# Altium schematic sheet KlokWave.Wave.SchDoc
size A4; SheetNumber: 2; SheetTotal: 3
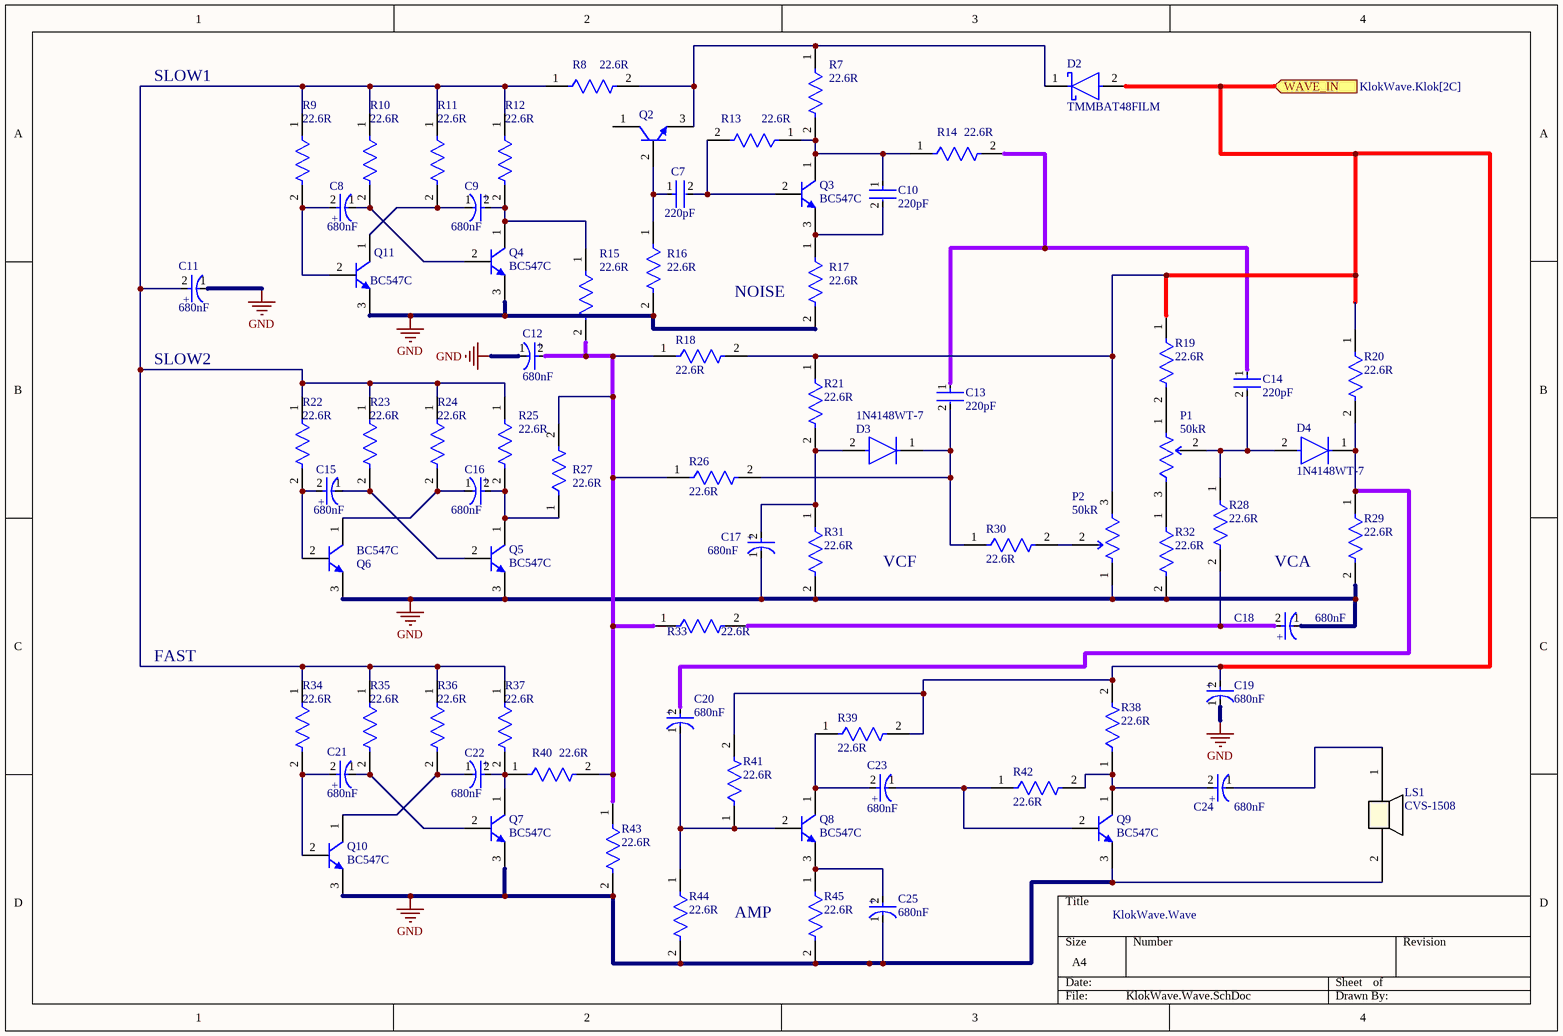
[diagram p0: KlokWave.Wave.SchDoc]

## Parts
C7  Capacitance: 220pF  [SMD RES: 0805ph]  (hidden comment: CL21C221FBANNNC)
C8  Capacitance: 680nF  [SMD Elco pol: FP-OS-CON-SMT-C6-MFG]  (hidden comment: FP-OS-CON-SMT-C6-MFG)
C9  Capacitance: 680nF  [SMD Elco pol: FP-OS-CON-SMT-C6-MFG]  (hidden comment: FP-OS-CON-SMT-C6-MFG)
C10  Capacitance: 220pF  [SMD RES: 0805ph]  (hidden comment: CL21C221FBANNNC)
C11  Capacitance: 680nF  [SMD Elco pol: FP-OS-CON-SMT-C6-MFG]  (hidden comment: FP-OS-CON-SMT-C6-MFG)
C12  Capacitance: 680nF  [SMD Elco pol: FP-OS-CON-SMT-C6-MFG]  (hidden comment: FP-OS-CON-SMT-C6-MFG)
C13  Capacitance: 220pF  [SMD RES: 0805ph]  (hidden comment: CL21C221FBANNNC)
C14  Capacitance: 220pF  [SMD RES: 0805ph]  (hidden comment: CL21C221FBANNNC)
C15  Capacitance: 680nF  [SMD Elco pol: FP-OS-CON-SMT-C6-MFG]  (hidden comment: FP-OS-CON-SMT-C6-MFG)
C16  Capacitance: 680nF  [SMD Elco pol: FP-OS-CON-SMT-C6-MFG]  (hidden comment: FP-OS-CON-SMT-C6-MFG)
C17  Capacitance: 680nF  [SMD Elco pol: FP-OS-CON-SMT-C6-MFG]  (hidden comment: FP-OS-CON-SMT-C6-MFG)
C18  Capacitance: 680nF  [SMD Elco pol: FP-OS-CON-SMT-C6-MFG]  (hidden comment: FP-OS-CON-SMT-C6-MFG)
C19  Capacitance: 680nF  [SMD Elco pol: FP-OS-CON-SMT-C6-MFG]  (hidden comment: FP-OS-CON-SMT-C6-MFG)
C20  Capacitance: 680nF  [SMD Elco pol: FP-OS-CON-SMT-C6-MFG]  (hidden comment: FP-OS-CON-SMT-C6-MFG)
C21  Capacitance: 680nF  [SMD Elco pol: FP-OS-CON-SMT-C6-MFG]  (hidden comment: FP-OS-CON-SMT-C6-MFG)
C22  Capacitance: 680nF  [SMD Elco pol: FP-OS-CON-SMT-C6-MFG]  (hidden comment: FP-OS-CON-SMT-C6-MFG)
C23  Capacitance: 680nF  [SMD Elco pol: FP-OS-CON-SMT-C6-MFG]  (hidden comment: FP-OS-CON-SMT-C6-MFG)
C24  Capacitance: 680nF  [SMD Elco pol: FP-OS-CON-SMT-C6-MFG]  (hidden comment: FP-OS-CON-SMT-C6-MFG)
C25  Capacitance: 680nF  [SMD Elco pol: FP-OS-CON-SMT-C6-MFG]  (hidden comment: FP-OS-CON-SMT-C6-MFG)
D2  TMMBAT48FILM  [SMD Diode BAT48 FP-MINIMELF-MFG]
D3  1N4148WT-7  [SMD Diode Rect: FP-SOD523-MFG]
D4  1N4148WT-7  [SMD Diode Rect: FP-SOD523-MFG]
LS1  CVS-1508  [THT speaker: CVS-1508_CUD]
P1  Resistance: 50kR  [SMD POT: FP-3361P-MFG]  (hidden comment: 3361P-1-503GLF)
P2  Resistance: 50kR  [SMD POT: FP-3361P-MFG]  (hidden comment: 3361P-1-503GLF)
Q2  BC547C  [THT NPN Transistor: ONSC-TO-92-3-29-11_AM_BL]  (value not drawn)
Q3  BC547C  [THT NPN Transistor: ONSC-TO-92-3-29-11_AM_BL]
Q4  BC547C  [THT NPN Transistor: ONSC-TO-92-3-29-11_AM_BL]
Q5  BC547C  [THT NPN Transistor: ONSC-TO-92-3-29-11_AM_BL]
Q6  BC547C  [THT NPN Transistor: ONSC-TO-92-3-29-11_AM_BL]
Q7  BC547C  [THT NPN Transistor: ONSC-TO-92-3-29-11_AM_BL]
Q8  BC547C  [THT NPN Transistor: ONSC-TO-92-3-29-11_AM_BL]
Q9  BC547C  [THT NPN Transistor: ONSC-TO-92-3-29-11_AM_BL]
Q10  BC547C  [THT NPN Transistor: ONSC-TO-92-3-29-11_AM_BL]
Q11  BC547C  [THT NPN Transistor: ONSC-TO-92-3-29-11_AM_BL]
R7  Resistance: 22.6R  [SMD RES: 0805ph]  (hidden comment: CR0805-FX-22R6ELF)
R8  Resistance: 22.6R  [SMD RES: 0805ph]  (hidden comment: CR0805-FX-22R6ELF)
R9  Resistance: 22.6R  [SMD RES: 0805ph]  (hidden comment: CR0805-FX-22R6ELF)
R10  Resistance: 22.6R  [SMD RES: 0805ph]  (hidden comment: CR0805-FX-22R6ELF)
R11  Resistance: 22.6R  [SMD RES: 0805ph]  (hidden comment: CR0805-FX-22R6ELF)
R12  Resistance: 22.6R  [SMD RES: 0805ph]  (hidden comment: CR0805-FX-22R6ELF)
R13  Resistance: 22.6R  [SMD RES: 0805ph]  (hidden comment: CR0805-FX-22R6ELF)
R14  Resistance: 22.6R  [SMD RES: 0805ph]  (hidden comment: CR0805-FX-22R6ELF)
R15  Resistance: 22.6R  [SMD RES: 0805ph]  (hidden comment: CR0805-FX-22R6ELF)
R16  Resistance: 22.6R  [SMD RES: 0805ph]  (hidden comment: CR0805-FX-22R6ELF)
R17  Resistance: 22.6R  [SMD RES: 0805ph]  (hidden comment: CR0805-FX-22R6ELF)
R18  Resistance: 22.6R  [SMD RES: 0805ph]  (hidden comment: CR0805-FX-22R6ELF)
R19  Resistance: 22.6R  [SMD RES: 0805ph]  (hidden comment: CR0805-FX-22R6ELF)
R20  Resistance: 22.6R  [SMD RES: 0805ph]  (hidden comment: CR0805-FX-22R6ELF)
R21  Resistance: 22.6R  [SMD RES: 0805ph]  (hidden comment: CR0805-FX-22R6ELF)
R22  Resistance: 22.6R  [SMD RES: 0805ph]  (hidden comment: CR0805-FX-22R6ELF)
R23  Resistance: 22.6R  [SMD RES: 0805ph]  (hidden comment: CR0805-FX-22R6ELF)
R24  Resistance: 22.6R  [SMD RES: 0805ph]  (hidden comment: CR0805-FX-22R6ELF)
R25  Resistance: 22.6R  [SMD RES: 0805ph]  (hidden comment: CR0805-FX-22R6ELF)
R26  Resistance: 22.6R  [SMD RES: 0805ph]  (hidden comment: CR0805-FX-22R6ELF)
R27  Resistance: 22.6R  [SMD RES: 0805ph]  (hidden comment: CR0805-FX-22R6ELF)
R28  Resistance: 22.6R  [SMD RES: 0805ph]  (hidden comment: CR0805-FX-22R6ELF)
R29  Resistance: 22.6R  [SMD RES: 0805ph]  (hidden comment: CR0805-FX-22R6ELF)
R30  Resistance: 22.6R  [SMD RES: 0805ph]  (hidden comment: CR0805-FX-22R6ELF)
R31  Resistance: 22.6R  [SMD RES: 0805ph]  (hidden comment: CR0805-FX-22R6ELF)
R32  Resistance: 22.6R  [SMD RES: 0805ph]  (hidden comment: CR0805-FX-22R6ELF)
R33  Resistance: 22.6R  [SMD RES: 0805ph]  (hidden comment: CR0805-FX-22R6ELF)
R34  Resistance: 22.6R  [SMD RES: 0805ph]  (hidden comment: CR0805-FX-22R6ELF)
R35  Resistance: 22.6R  [SMD RES: 0805ph]  (hidden comment: CR0805-FX-22R6ELF)
R36  Resistance: 22.6R  [SMD RES: 0805ph]  (hidden comment: CR0805-FX-22R6ELF)
R37  Resistance: 22.6R  [SMD RES: 0805ph]  (hidden comment: CR0805-FX-22R6ELF)
R38  Resistance: 22.6R  [SMD RES: 0805ph]  (hidden comment: CR0805-FX-22R6ELF)
R39  Resistance: 22.6R  [SMD RES: 0805ph]  (hidden comment: CR0805-FX-22R6ELF)
R40  Resistance: 22.6R  [SMD RES: 0805ph]  (hidden comment: CR0805-FX-22R6ELF)
R41  Resistance: 22.6R  [SMD RES: 0805ph]  (hidden comment: CR0805-FX-22R6ELF)
R42  Resistance: 22.6R  [SMD RES: 0805ph]  (hidden comment: CR0805-FX-22R6ELF)
R43  Resistance: 22.6R  [SMD RES: 0805ph]  (hidden comment: CR0805-FX-22R6ELF)
R44  Resistance: 22.6R  [SMD RES: 0805ph]  (hidden comment: CR0805-FX-22R6ELF)
R45  Resistance: 22.6R  [SMD RES: 0805ph]  (hidden comment: CR0805-FX-22R6ELF)

## Ports
WAVE_IN (in, see KlokWave.Klok[2C])

## Nets
GND: C11.1(C) C12.1(C) C17.1(C) C18.1(C) C19.1(C) C25.1(C) LS1.2 P2.1(CCW) Q4.3(E) Q5.3(E) Q6.3(E) Q7.3(E) Q9.3(E) Q10.3(E) Q11.3(E) R16.2 R17.2 R29.2 R31.2 R32.2 R43.2 R44.2 R45.2
WAVE_IN: C19.2(A) D2.2(A) P2.3(CW) R18.2 R19.1 R20.1 R21.1 R38.2 R39.2 R41.2 ; port WAVE_IN
NetC7_1: C7.1 Q2.2(B) R16.1
NetC7_2: C7.2 Q3.2(B) R13.2
NetC8_1: C8.1(C) Q4.2(B) R10.2
NetC8_2: C8.2(A) Q11.2(B) R9.2
NetC9_1: C9.1(C) Q11.1(C) R11.2
NetC9_2: C9.2(A) Q4.1(C) R12.2 R15.1
NetC10_1: C10.1 Q3.1(C) R7.2 R13.1 R14.1
NetC10_2: C10.2 Q3.3(E) R17.1
NetC11_2: C11.2(A) R8.1 R9.1 R10.1 R11.1 R12.1 R22.1 R23.1 R24.1 R25.1 R34.1 R35.1 R36.1 R37.1
NetC12_2: C12.2(A) R15.2 R18.1 R26.1 R27.2 R33.1 R40.2 R43.1
NetC13_1: C13.1 C14.1 R14.2
NetC13_2: C13.2 D3.1(C) R26.2 R30.1
NetC14_2: C14.2 D4.2(A) P1.2(WIPER) R28.1
NetC15_1: C15.1(C) Q5.2(B) R23.2
NetC15_2: C15.2(A) Q6.2(B) R22.2
NetC16_1: C16.1(C) Q6.1(C) R24.2
NetC16_2: C16.2(A) Q5.1(C) R25.2 R27.1
NetC17_2: C17.2(A) D3.2(A) R21.2 R31.1
NetC18_2: C18.2(A) R28.2 R33.2
NetC20_1: C20.1(C) Q8.2(B) R41.1 R44.1
NetC20_2: C20.2(A) D4.1(C) R20.2 R29.1
NetC21_1: C21.1(C) Q7.2(B) R35.2
NetC21_2: C21.2(A) Q10.2(B) R34.2
NetC22_1: C22.1(C) Q10.1(C) R36.2
NetC22_2: C22.2(A) Q7.1(C) R37.2 R40.1
NetC23_1: C23.1(C) Q9.2(B) R42.1
NetC23_2: C23.2(A) Q8.1(C) R39.1
NetC24_1: C24.1(C) LS1.1
NetC24_2: C24.2(A) Q9.1(C) R38.1 R42.2
NetC25_2: C25.2(A) Q8.3(E) R45.1
NetD2_1: D2.1(C) Q2.3(E) R7.1 R8.2
NetP1_1: P1.1(CCW) R19.2
NetP1_3: P1.3(CW) R32.1
NetP2_2: P2.2(WIPER) R30.2

Not connected (* = marked no-connect by the designer): Q2 1(C)

## Notes on the sheet
- SLOW1
- NOISE
- SLOW2
- VCF
- VCA
- FAST
- AMP
- KlokWave.Wave
- (in symbol FP-OS-CON-SMT-C6-MFG) +

## Library data of the parts
C7 C10 C13 C14 = CMP-13271-000769-1: SMD cap nonpol: CL21 Series 0805 220pF 50V ±1% Tolerance C0G Multilayer Ceramic Chip Capacitor; Min Operating Temperature: -55°C; Radiation Hardening: No; Case/Package: 0805; Max Operating Temperature: 125°C; Height: 0.65mm; Depth: 1.25mm; Packaging: Tape and Reel; Thickness: 0.03inch; Voltage Rating: 50V; Case Code (Imperial): 0805; Lead Free: Lead Free; Width: 0.049inch; Tolerance: 1%; Mount: Surface Mount; Dielectric: C0G; Case Code (Metric): 2012; Material: Ceramic; Voltage Rating (DC): 50V; Package Quantity: 1; Length: 0.079inch
C8 C9 C11 C12 C15-C25 = FP-OS-CON-SMT-C6-MFG: SMD Elco Capacitor; Leakage Current: 500nA; Tolerance: 10%; Dissipation Factor: 4%; ESR (Equivalent Series Resistance): 25R; Voltage Rating: 16V; Dielectric Material: Tantalum; Mount: Surface Mount; Termination: SMD/SMT; Construction: Flat; Height: 1.2mm; Series: TAJ; Width: 1.3mm; Case Code (Imperial): 0805; Length: 2.05mm; Package Quantity: 2500; Min Operating Temperature: -55°C; Radiation Hardening: No; Lead Free: Lead Free; Case/Package: 0805; Height - Seated (Max): 0.047inch; Weight: 0.000194oz; Voltage Rating (DC): 16V; Features: General Purpose; Depth: 1.3mm; RoHS Compliant: Yes; Case Code (Metric): 2012; Packaging: Tape and Reel; Max Operating Temperature: 125°C; REACH SVHC: No SVHC
D2 = CMP-12187-000003-1: Rectifier Diode BAT48 SCHOTTKY 40V 350MA MINMELF; Manufacturer: STMicroelectronics; Max Surge Forward Current: 1.5A; Value: 20pF; Max Junction Temp: +125°C; Peak Reverse Current: 25uA; ComponentLink2Description: Datasheet; Manufacturer Part Number: TMMBAT48FILM; Height: 1.62mm; Forward Current: 350mA; Temperature: -65°C to +125°C; Max Repetitive Reverse Voltage: 40V; Category: Diode; Temperature Range Low: -65°C; Reverse Voltage: 40V; Device Class L3: Schottky Diodes; RoHS: TRUE; Digikey Description: DIODE SCHOTTKY 40V 350MA MINMELF; ComponentLink2URL: https://www.st.com/resource/en/datasheet/tmmbat48.pdf; Temperature Range High: +125°C; Octopart: https://octopart.com/tmmbat48film-stmicroelectronics-324396; Lead Free: Yes; Capacitance: 20pF; Device Class L1: Discrete Semiconductors; Device Class L2: Diodes; Automotive: No; Package: MINIMELF; Mouser Description: Schottky Diodes & Rectifiers 350mA 40 Volt
D3 D4 = CMP-2000-05518-3: Rectifier Diode 1N4148 GEN PURP 80V 125MA SOD523; Power Rating: 150mW; Peak Non-Repetitive Surge Current: 2A; Forward Voltage: 1.25V; Reverse Recovery Time: 4ns; Peak Reverse Current: 1uA; Max Repetitive Reverse Voltage (Vrrm): 100V; Capacitance: 2pF; Polarity: Standard; Element Configuration: Single; Forward Current: 250mA; Lead Free: Lead Free; Packaging: Tape and Reel; Length: 0.9mm; Min Operating Temperature: -65°C; Current Rating: 125mA; Max Reverse Voltage (DC): 80V; Width: 1.3mm; Package Quantity: 3000; Output Current: 125mA; Power Dissipation: 150mW; Max Operating Temperature: 150°C; Radiation Hardening: No; Average Rectified Current: 125mA; Height: 0.65mm; Voltage Rating (DC): 80V; Max Surge Current: 2A; Weight: 3.5E-05oz; Recovery Time: 4ns; Max Forward Surge Current (Ifsm): 2A; Contact Plating: Tin; Number of Pins: 2; Mount: Surface Mount; REACH SVHC: No SVHC
LS1 = CVS-1508: THT Speaker; Mfr_Name: Same Sky; RefDes: RefDes; Type: Type
P1 P2 = CMP-07234-000057-1: SMD TRIMMER 50K OHM 0.5W GW TOP ADJ; Power Rating: 500mW; Voltage Rating: 300V; Resistance Tolerance: 10%; Number of Turns: 1; Temperature Coefficient: 100ppm/°C; Height: 0.205inch; Radiation Hardening: No; RoHS Compliant: Yes; Length: 6.71mm; Depth: 8.53mm; Max Operating Temperature: 125°C; Military Standard: Not; Weight: 0.567g; Technology: CERMET; Voltage Rating (DC): 300V; Width: 0.264inch; Packaging: Tape and Reel; Lead Free: Lead Free; Tolerance: 10%; Reach SVHC Compliant: Yes; Taper: Linear; Min Operating Temperature: -55°C; Color: Natural; Package Quantity: 1; Resistor Type: Cermet; Contact Plating: Tin; Series: 3361; Mount: Surface Mount; Termination: Gull Wing; Max Power Dissipation: 500mW
Q2-Q11 = CMP-1048-01437-1: BC547C: THT Amplifier Transistor, NPN Silicon, 3-Pin TO-92, Bulk Box; Manufacturer: On Semiconductor; IC Continuous (A): 0.1; fT Min (MHz): 150; Mounting Technology: Through Hole; ComponentLink1URL: http://www.onsemi.com/; ComponentLink1Description: Manufacturer URL; ComponentLink3URL: http://www.onsemi.cn/pub_link/Collateral/2N6426-D.PDF; DatasheetVersion: Rev. 7; PackageVersion: Rev. AM; Packing: Bulk Box; RoHS: FALSE; Polarity: NPN; PartNumber: BC547C; ComponentLink2URL: http://www.onsemi.com/pub_link/Collateral/BC546-D.PDF; ComponentLink3Description: Package Specification; PackageDescription: 3-Pin Transistor Outline, Body 4.825 x 3.685 mm, Pitch 1.27 mm; PackageReference: TO-92-3-29-11_AM_SL; ComponentLink2Description: Datasheet
R7-R45 = CMP-07231-006076-1: Thick Film Chip Resistors 0805 22.6Ω 0.125W 1% 100ppm/°C; Max Power Dissipation: 125mW; Voltage Rating: 150V; Package Quantity: 5000; Height: 0.024inch; Series: CR0805; Width: 0.049inch; Min Operating Temperature: -55°C; Max Operating Temperature: 155°C; Length: 2mm; Depth: 1.25mm; Military Standard: Not; Features: Moisture Resistant; Mount: Surface Mount; Tolerance: 1%; Termination: SMD/SMT; Contact Plating: Tin; Thickness: 508um; Resistor Type: Thick Film; Construction: Rectangular; Power Rating: 125mW; Case Code (Imperial): 0805; Case Code (Metric): 2012; Packaging: Tape and Reel; Temperature Coefficient: 100ppm/°C; Case/Package: 0805; Radiation Hardening: No; Number of Terminations: 2